# Altium schematic sheet MCU Power-2.SchDoc
size A3; Author: ALP Electronics; CompanyName: ALP Electronics; DrawnBy: Caner Alp; Engineer: Caner Alp; Organization: ALP Electronics; Address2: Västerås; Address4: Sweden; SheetNumber: 4; SheetTotal: 13
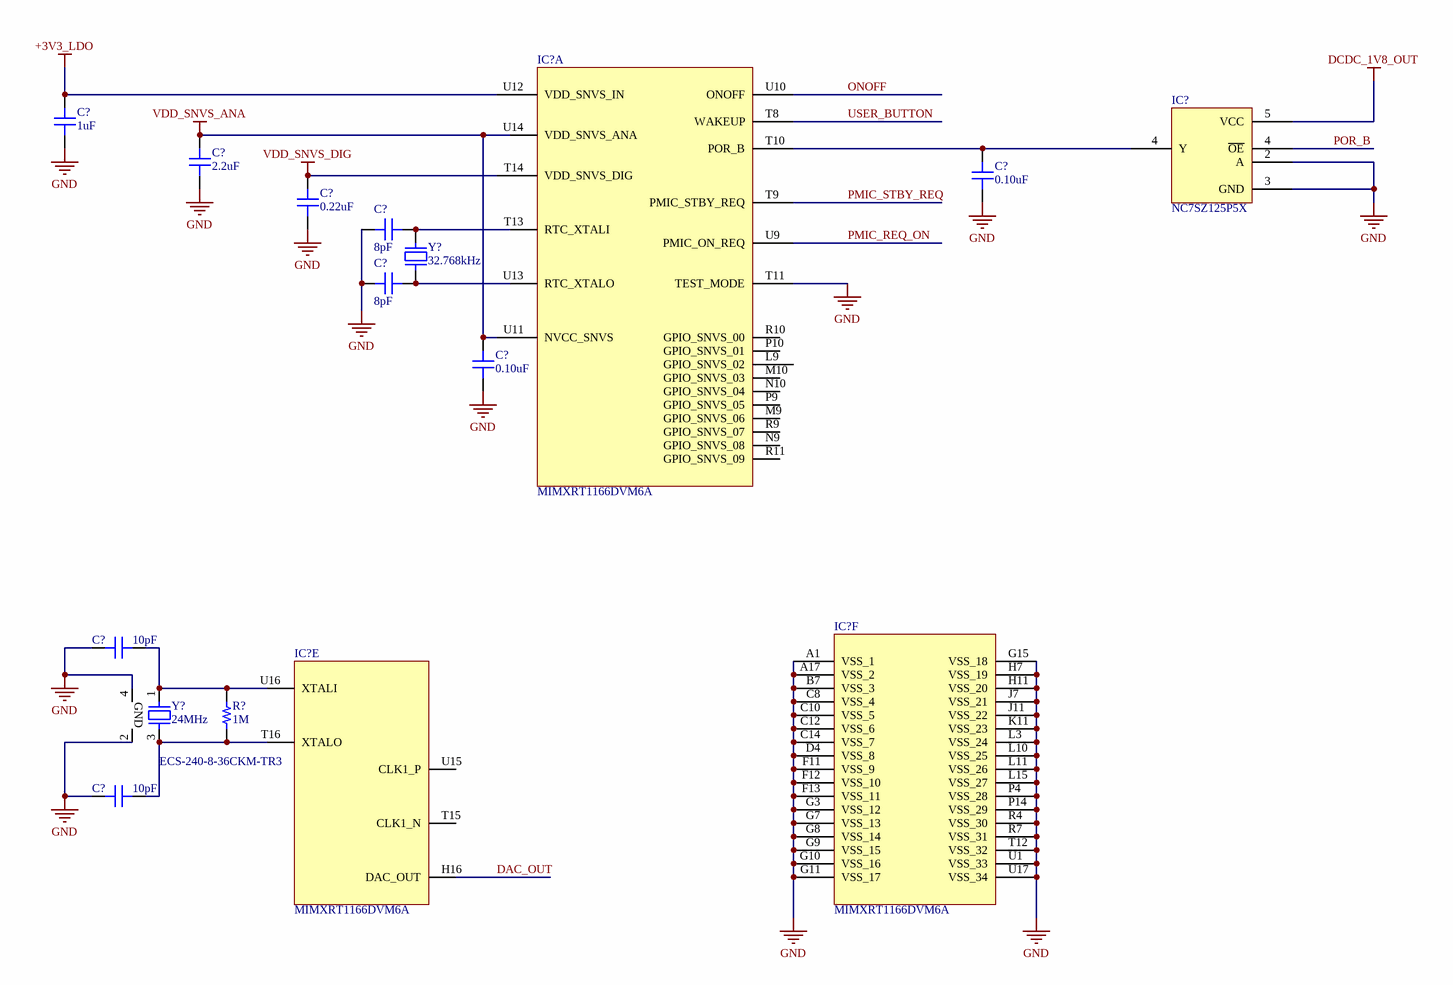
[diagram p0: MCU Power-2.SchDoc]

## Parts
(Parts that share a designator on the sheet are numbered #1, #2 ... from top to bottom, then left to right.)
C?#1  1uF  [CAP 0402/1005]
C?#2  2.2uF  [CAP 0402/1005]
C?#3  0.10uF  [CAP 0402/1005]
C?#4  0.22uF  [CAP 0402/1005]
C?#5  8pF  [CAP 0402/1005]
C?#6  8pF  [CAP 0402/1005]
C?#7  0.10uF  [CAP 0402/1005]
C?#8  10pF  [CAP 0402/1005]
C?#9  10pF  [CAP 0402/1005]
IC?#1  MIMXRT1166DVM6A  [BGA289C80P17X17_1400X1400X152]  (part A of 12)
IC?#2  NC7SZ125P5X  [ON SEMI SC70-5  419AC-01]
IC?#3  MIMXRT1166DVM6A  [BGA289C80P17X17_1400X1400X152]  (part F of 12)
IC?#4  MIMXRT1166DVM6A  [BGA289C80P17X17_1400X1400X152]  (part E of 12)
R?  1M  [RES 0402/1005]
Y?#1  32.768kHz  [ABRACON ABS07]
Y?#2  24MHz  Part Number: ECS-240-8-36CKM-TR3  [NDK NX2520SA]

## Nets
+3V3_LDO: C?#1.2 IC?#1.U12(VDD_SNVS_IN)
DCDC_1V8_OUT: IC?#2.5(VCC)
GND: C?#1.1 C?#2.1 C?#3.1 C?#4.1 C?#5.1 C?#6.1 C?#7.1 C?#8.1 C?#9.1 IC?#1.T11(TEST_MODE) IC?#2.2(A) IC?#2.3(GND) IC?#3.A1(VSS_1) IC?#3.A17(VSS_2) IC?#3.B7(VSS_3) IC?#3.C8(VSS_4) IC?#3.C10(VSS_5) IC?#3.C12(VSS_6) IC?#3.C14(VSS_7) IC?#3.D4(VSS_8) IC?#3.F11(VSS_9) IC?#3.F12(VSS_10) IC?#3.F13(VSS_11) IC?#3.G3(VSS_12) IC?#3.G7(VSS_13) IC?#3.G8(VSS_14) IC?#3.G9(VSS_15) IC?#3.G10(VSS_16) IC?#3.G11(VSS_17) IC?#3.G15(VSS_18) IC?#3.H7(VSS_19) IC?#3.H11(VSS_20) IC?#3.J7(VSS_21) IC?#3.J11(VSS_22) IC?#3.K11(VSS_23) IC?#3.L3(VSS_24) IC?#3.L10(VSS_25) IC?#3.L11(VSS_26) IC?#3.L15(VSS_27) IC?#3.P4(VSS_28) IC?#3.P14(VSS_29) IC?#3.R4(VSS_30) IC?#3.R7(VSS_31) IC?#3.T12(VSS_32) IC?#3.U1(VSS_33) IC?#3.U17(VSS_34) Y?#2.2(GND) Y?#2.4(GND)
VDD_SNVS_ANA: C?#2.2 C?#7.2 IC?#1.U11(NVCC_SNVS) IC?#1.U14(VDD_SNVS_ANA)
VDD_SNVS_DIG: C?#4.2 IC?#1.T14(VDD_SNVS_DIG)
DAC_OUT: IC?#4.H16(DAC_OUT)
ONOFF: IC?#1.U10(ONOFF)
PMIC_REQ_ON: IC?#1.U9(PMIC_ON_REQ)
PMIC_STBY_REQ: IC?#1.T9(PMIC_STBY_REQ)
POR_B: IC?#2.4(~{OE})
USER_BUTTON: IC?#1.T8(WAKEUP)
NetC?#3_2: C?#3.2 IC?#1.T10(POR_B) IC?#2.4(Y)
NetC?#5_2: C?#5.2 IC?#1.T13(RTC_XTALI) Y?#1.2
NetC?#6_2: C?#6.2 IC?#1.U13(RTC_XTALO) Y?#1.1
NetC?#8_2: C?#8.2 IC?#4.U16(XTALI) R?.2 Y?#2.1
NetC?#9_2: C?#9.2 IC?#4.T16(XTALO) R?.1 Y?#2.3

Not connected (* = marked no-connect by the designer): IC?#1 L9(GPIO_SNVS_02) M9(GPIO_SNVS_06) M10(GPIO_SNVS_03) N9(GPIO_SNVS_08) N10(GPIO_SNVS_04) P9(GPIO_SNVS_05) P10(GPIO_SNVS_01) R9(GPIO_SNVS_07) R10(GPIO_SNVS_00) R11(GPIO_SNVS_09); IC?#4 T15(CLK1_N) U15(CLK1_P)

## Notes on the sheet
- Title:
- Size:
- Project:
- A3
- Date:
- Revision:
- Drawn By:
- Sheet
- of

## Library data of the parts
C?#1 = GRM155R60J105KE19D: CAP CER 1UF 6.3V X5R 0402; Manufacturer: Murata Electronics North America; TemperatureRange: -55C ~ 85C; Tolerance: 10%; Value: 1uF; Part Number: GRM155R60J105KE19D; PartId: 12330; Supplier 1: Digi-Key; Supplier Part Number 1: 490-1320-2-ND; ComponentLink1Description: Datasheet; ComponentLink1URL: http://www.murata.com/~/media/webrenewal/support/library/catalog/products/capacitor/mlcc/c02e.pdf; ComponentLink2Description: Digi-Key Listing; ComponentLink2URL: https://www.digikey.com/product-detail/en/murata-electronics-north-america/GRM155R60J105KE19D/490-1320-2-ND/587208; TemperatureCoefficient: X5R; Voltage: 6.3V; Price: 0,006; Device Package: 0402 (1005 Metric)
C?#2 = JMK105BJ225MV-F: CAP CER 2.2UF 6.3V X5R 0402; Manufacturer: Taiyo Yuden; TemperatureRange: -55C ~ 85C; Tolerance: 20%; Value: 2.2uF; Part Number: JMK105BJ225MV-F; PartId: 12339; Supplier 1: Digi-Key; Supplier Part Number 1: 587-1453-2-ND; ComponentLink1Description: Datasheet; ComponentLink1URL: http://ds.yuden.co.jp/TYCOMPAS/ut/detail.do?productNo=JMK105BJ225MV-F&fileName=JMK105BJ225MV-F_SS&mode=specSheetDownload; ComponentLink2Description: Digi-Key Listing; ComponentLink2URL: https://www.digikey.com/product-detail/en/taiyo-yuden/JMK105BJ225MV-F/587-1453-2-ND/1004041; TemperatureCoefficient: X5R; Voltage: 6.3V; Price: 0,028; Device Package: 0402 (1005 Metric)
C?#3 C?#7 = LMK105BJ104KV-F: CAP CER 0.1UF 10V X5R 0402; Manufacturer: Taiyo Yuden; TemperatureRange: -55C ~ 85C; Tolerance: 10%; Value: 0.10uF; Part Number: LMK105BJ104KV-F; PartId: 12322; Supplier 1: Digi-Key; Supplier Part Number 1: 587-1227-2-ND; ComponentLink1Description: Datasheet; ComponentLink1URL: http://ds.yuden.co.jp/TYCOMPAS/ut/detail.do?productNo=LMK105BJ104KV-F&fileName=LMK105BJ104KV-F_SS&mode=specSheetDownload; ComponentLink2Description: Digi-Key Listing; ComponentLink2URL: https://www.digikey.com/product-detail/en/taiyo-yuden/LMK105BJ104KV-F/587-1227-2-ND/930579; TemperatureCoefficient: X5R; Voltage: 10V; Price: 0,0021; Device Package: 0402 (1005 Metric)
C?#4 = LMK105BJ224KV-F: CAP CER 0.22UF 10V X5R 0402; Manufacturer: Taiyo Yuden; TemperatureRange: -55C ~ 85C; Tolerance: 10%; Value: 0.22uF; Part Number: LMK105BJ224KV-F; PartId: 12369; Supplier 1: Digi-Key; Supplier Part Number 1: 587-1228-2-ND; ComponentLink1Description: Datasheet; ComponentLink1URL: http://ds.yuden.co.jp/TYCOMPAS/ut/detail.do?productNo=LMK105BJ224KV-F&fileName=LMK105BJ224KV-F_SS&mode=specSheetDownload; ComponentLink2Description: Digi-Key Listing; ComponentLink2URL: https://www.digikey.com/product-detail/en/taiyo-yuden/LMK105BJ224KV-F/587-1228-2-ND/930580; TemperatureCoefficient: X5R; Voltage: 10V; Price: 0,0094; Device Package: 0402 (1005 Metric)
C?#5 C?#6 = C1005C0G1H080C050BA: CAP CER 8PF 50V C0G 0402; Manufacturer: TDK Corporation; TemperatureRange: -55C ~ 125C; TemperatureCoefficient: C0G, NP0; Tolerance: 0.25pF; Value: 8pF; Part Number: C1005C0G1H080C050BA; PartId: 3903; Supplier 1: Digi-Key; Supplier Part Number 1: 445-4890-2-ND; ComponentLink1Description: Datasheet; ComponentLink1URL: https://product.tdk.com/info/en/catalog/datasheets/mlcc_commercial_general_en.pdf; ComponentLink2Description: Digi-Key listing; ComponentLink2URL: http://digikey.com/product-detail/en/C1005C0G1H080C050BA/445-4890-2-ND/2093158; Voltage: 50V; Price: 0,0066; Type: -; Device Package: 0402 (1005 Metric)
C?#8 C?#9 = C1005C0G1H100D050BA: CAP CER 10PF 50V C0G 0402; Manufacturer: TDK Corporation; TemperatureRange: -55C ~ 125C; TemperatureCoefficient: C0G, NP0; Tolerance: 0.5pF; Value: 10pF; Part Number: C1005C0G1H100D050BA; PartId: 3878; Supplier 1: Digi-Key; Supplier Part Number 1: 445-1235-2-ND; ComponentLink1Description: Datasheet; ComponentLink1URL: https://product.tdk.com/info/en/catalog/datasheets/mlcc_commercial_general_en.pdf; ComponentLink2Description: Digi-Key listing; ComponentLink2URL: http://digikey.com/product-detail/en/C1005C0G1H100D050BA/445-1235-2-ND/513663; Voltage: 50V; Price: 0,006; Type: -; Device Package: 0402 (1005 Metric)
IC?#1 IC?#3 IC?#4 = MIMXRT1166DVM6A: Integrated Circuit; Manufacturer_Name: NXP; Datasheet Link: https://www.mouser.in/datasheet/2/302/IMXRT1160CEC-2335852.pdf; Height: 1.52mm; Manufacturer_Part_Number: MIMXRT1166DVM6A; Mouser Part Number: 771-MIMXRT1166DVM6A; Mouser Price/Stock: https://www.mouser.co.uk/ProductDetail/NXP-Semiconductors/MIMXRT1166DVM6A?qs=DRkmTr78QARbPfoaiaD1vg%3D%3D
IC?#2 = NC7SZ125P5X: IC BUF NON-INVERT 5.5V SC70-5; Manufacturer: ON Semiconductor; Current - Output High, Low: 32mA, 32mA; Logic Type: Buffer, Non-Inverting; Number of Bits per Element: 1; Output Type: 3-State; Voltage - Supply: 1.65V ~ 5.5V; Part Number: NC7SZ125P5X; ComponentLink1Description: Datasheet; ComponentLink1URL: https://www.onsemi.com/pub/Collateral/NC7SZ125-D.PDF; ComponentLink2Description: DigiKey Link; ComponentLink2URL: //digikey.com/product-detail/en/on-semiconductor/NC7SZ125P5X/NC7SZ125P5XTR-ND/673366; Device Package: 5-TSSOP, SC-70-5, SOT-353; LastUpdated: 2019-12-09 01:20:32; Lifecycle Status: 0; Minimum Order: 1; Mounting Type: Surface Mount; Number of Elements: 1; Operating Temperature: -40°C ~ 85°C (TA); Package / Case: 5-TSSOP, SC-70-5, SOT-353; Packaging: TapeAndReel; PartId: 2; Part Status: Active; Price: 0.07; Series: 7SZ; Supplier 1: DigiKey; Supplier Part Number 1: NC7SZ125P5XTR-ND; Supplier Device Package: SC-70-5
R? = RC0402JR-071ML: RES SMD 1M OHM 5% 1/16W 0402; Manufacturer: Yageo; TemperatureRange: -55C ~ 155C; TemperatureCoefficient: 100ppm/C; PowerRating: 0.063W, 1/16W; Value: 1M; Part Number: RC0402JR-071ML; PartId: 14469; Supplier 1: Digi-Key; Supplier Part Number 1: 311-1.0MJRTR-ND; ComponentLink1Description: Datasheet; ComponentLink1URL: http://www.yageo.com/documents/recent/PYu-RC_Group_51_RoHS_L_04.pdf; ComponentLink2Description: Digi-Key Listing; ComponentLink2URL: https://www.digikey.com/product-detail/en/yageo/RC0402JR-071ML/311-1.0MJRTR-ND/726409; Tolerance: 5%; Price: 0,0017; Device Package: 0402 (1005 Metric)
Y?#1 = ABS07-120-32.768KHZ-T: CRYSTAL 32.7680KHZ 6PF SMD; Manufacturer: Abracon LLC; Frequency Tolerance: 20ppm; ESR: 55 kOhm; Operating Mode: Fundamental; Part Number: ABS07-120-32.768KHZ-T; PartId: 8490; Supplier 1: Digi-Key; Supplier Part Number 1: 535-11937-2-ND; ComponentLink1Description: Datasheet; ComponentLink1URL: http://www.abracon.com/Resonators/ABS07-120-32.768kHz-T.pdf; ComponentLink2Description: Digi-Key Listing; ComponentLink2URL: http://www.digikey.com/product-detail/en/ABS07-120-32.768KHZ-T/535-11937-2-ND/3724043; Price: 0,3784; Type: kHz Crystal (Tuning Fork); Device Package: 2-SMD; Frequency: 32.768kHz; Frequency Stability: -; Load Capacitance: 6pF
Y?#2 = NX2520SA-24.000000MHZ-B8: CRYSTAL 24.0000MHZ 10PF SMD; Manufacturer: NDK; Frequency Stability: 10ppm; ESR: 100 Ohm; Operating Mode: Fundamental; PartId: 8499; Supplier 1: Digi-Key; Supplier Part Number 1: 644-1094-2-ND; ComponentLink1Description: Datasheet; ComponentLink1URL: http://media.digikey.com/pdf/Data Sheets/NDK PDFs/NX2520SA-24.000000MHz-B8.pdf; ComponentLink2Description: Digi-Key Listing; ComponentLink2URL: http://www.digikey.com/product-detail/en/NX2520SA-24.000000MHZ-B8/644-1094-2-ND/1468335; Price: 0,7938; Type: MHz Crystal; Device Package: 4-SMD, No Lead (DFN, LCC); Frequency: 24MHz; Frequency Tolerance: 10ppm; Load Capacitance: 10pF